# Altium schematic sheet OPAMP_TESTER.SchDoc: OPAMP_TESTER
size A4; CheckedBy: D.MOHAMMADI; DrawnBy: A.RAJABI; SheetNumber: 1; SheetTotal: 3
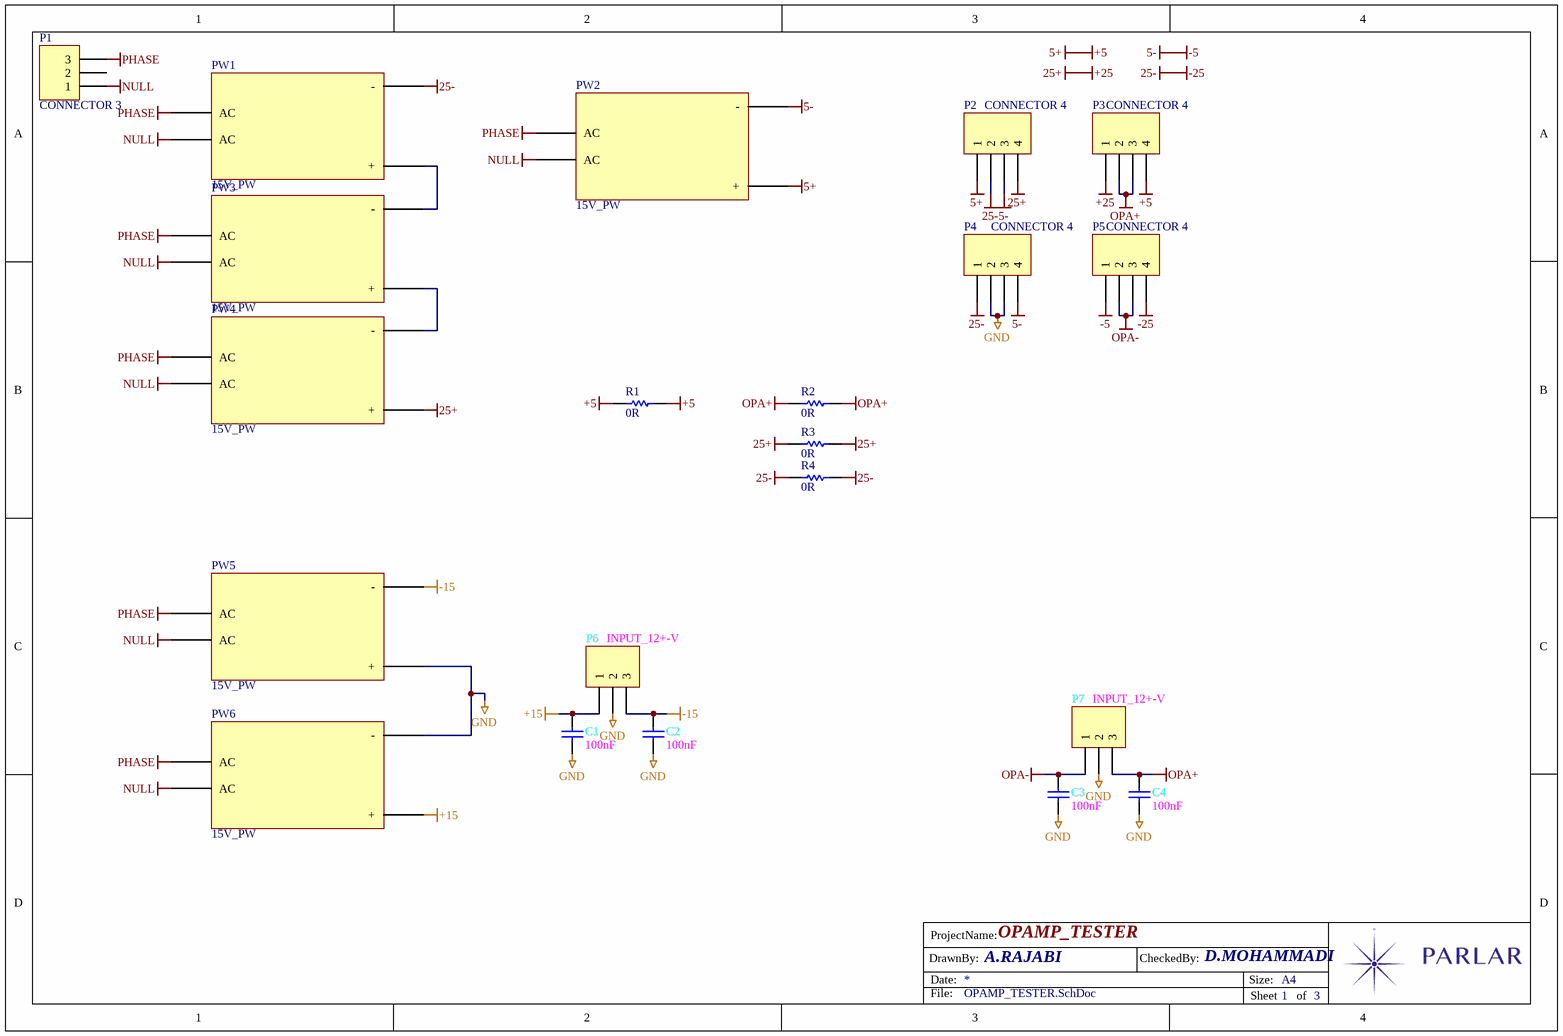
[diagram p0: OPAMP_TESTER.SchDoc]

## Parts
C1  100nF  [SMD 0805]
C2  100nF  [SMD 0805]
C3  100nF  [SMD 0805]
C4  100nF  [SMD 0805]
P1  CONNECTOR 3  [CON VH 3]
P2  CONNECTOR 4  [CON HDR 2.54M 4]
P3  CONNECTOR 4  [CON HDR 2.54M 4]
P4  CONNECTOR 4  [CON HDR 2.54M 4]
P5  CONNECTOR 4  [CON HDR 2.54M 4]
P6  INPUT_12+-V  [CON XH 3]
P7  INPUT_12+-V  [CON XH 3]
PW1  15V_PW  [POW_15V]
PW2  15V_PW  [POW_5V]
PW3  15V_PW  [POW_5V]
PW4  15V_PW  [POW_5V]
PW5  15V_PW  [POW_15V]
PW6  15V_PW  [POW_15V]
R1  0R  [SMD 1206]
R2  0R  [SMD 1206]
R3  0R  [SMD 1206]
R4  0R  [SMD 1206]

## Nets
+5: P2.1 P3.4 PW2.3(+) R1.1 R1.2  [also labelled 5+]
+15: C1.2 P6.1 PW6.3(+)
+25: P2.4 P3.1 PW4.3(+) R3.1 R3.2  [also labelled 25+]
-5: P2.3 P4.4 P5.1 PW2.4(-)  [also labelled 5-]
-15: C2.2 P6.3 PW5.4(-)
-25: P2.2 P4.1 P5.4 PW1.4(-) R4.1 R4.2  [also labelled 25-]
GND: C1.1 C2.1 C3.1 C4.1 P4.2 P4.3 P6.2 P7.2 PW5.3(+) PW6.4(-)
NULL: P1.1 PW1.2(AC) PW2.2(AC) PW3.2(AC) PW4.2(AC) PW5.2(AC) PW6.2(AC)
OPA+: C4.2 P3.2 P3.3 P7.3 R2.1 R2.2
OPA-: C3.2 P5.2 P5.3 P7.1
PHASE: P1.3 PW1.1(AC) PW2.1(AC) PW3.1(AC) PW4.1(AC) PW5.1(AC) PW6.1(AC)
NetPW1_3: PW1.3(+) PW3.4(-)
NetPW3_3: PW3.3(+) PW4.4(-)

Not connected (* = marked no-connect by the designer): P1 2

## Notes on the sheet
- DrawnBy:
- ProjectName:
- Date:
- CheckedBy:
- Size:
- A4
- File:
- Sheet
- of

## Library data of the parts
C1-C4 = CAP: Capacitor; Published: 8-Jun-2000; LatestRevisionDate: 17-Jul-2002; LatestRevisionNote: Re-released for DXP Platform.; PackageReference: RAD-0.3; Publisher: Altium Limited; PackageDescription: Radial Cap, Thru-Hole; 2 Leads; 0.3 in Pin Spacing
P1 P6 P7 = CONNECTOR 3: Header, 3-Pin; LatestRevisionDate: 17-Jul-2002; LatestRevisionNote: Re-released for DXP Platform.; Publisher: Altium Limited
P2-P5 = CONNECTOR 4: Header, 4-Pin; LatestRevisionDate: 17-Jul-2002; LatestRevisionNote: Re-released for DXP Platform.; Publisher: Altium Limited
PW1-PW6 = POWER
R1-R4 = RES: Resistor